# Altium schematic sheet [6]-CHARGER.SchDoc
size A4
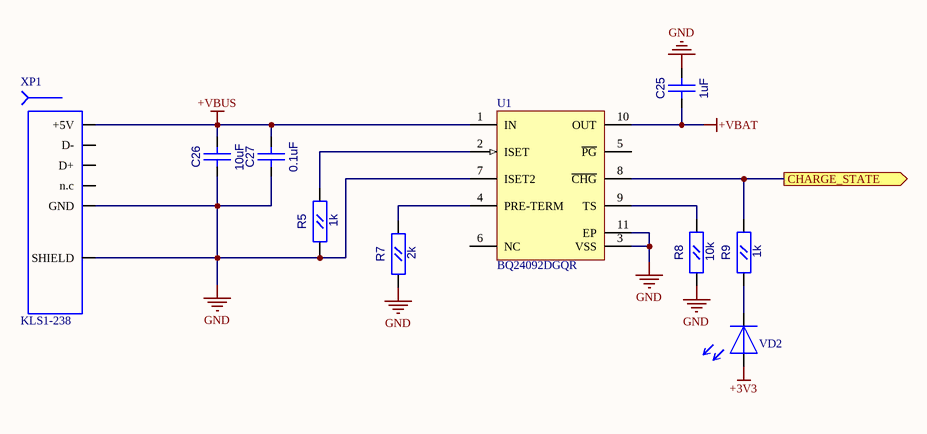
[diagram p0: [6]-CHARGER.SchDoc]

## Parts
C25  1uF  [CC0603]
C26  10uF  [CC0805]
C27  0.1uF  [CC0603]
R5  1k  [RC0603]
R7  2k  [RC0603]
R8  10k  [RC0603]
R9  1k  [RC0603]
U1  BQ24092DGQR  [DGQ10-1675X1445TP_N]
VD2  LED_0805  [LED0805]  (value not drawn)
XP1  KLS1-238  [KLS1-238]

## Ports
CHARGE_STATE (out)

## Nets
+3V3: VD2.1
+VBAT: C25.1(A) U1.10(OUT)
+VBUS: C26.2(B) C27.2(B) U1.1(IN) XP1.1(+5V)
GND: C25.2(B) C26.1(A) C27.1(A) R5.1(A) R7.1(A) R8.1(A) U1.3(VSS) U1.7(ISET2) U1.11(EP) XP1.5(GND) XP1.6(SHIELD)
CHARGE_STATE: R9.2(B) U1.8(~{CHG}) ; port CHARGE_STATE
NetR5_2: R5.2(B) U1.2(ISET)
NetR7_2: R7.2(B) U1.4(PRE-TERM)
NetR8_2: R8.2(B) U1.9(TS)
NetR9_1: R9.1(A) VD2.2

Not connected (* = marked no-connect by the designer): U1 5(~{PG}) 6(NC); XP1 2(D-) 3(D+) 4(n.c)

## Library data of the parts
C25 C27 = CC0603
  C25: Value: 1uF
  C27: Value: 0.1uF
C26 = CC0805: Value: 10uF
R5 R7-R9 = RC0603
  R5 R9: Value: 1k
  R7: Value: 2k
  R8: Value: 10k
U1 = BQ24092DGQR: 1 A, Single-Input, Single-Cell Li-Ion Battery Charger with Operation Over JEITA and 10 k ohm NTC, 4.5 V, -40 to 150 degC, 10-pin MSOP-PowerPAD (DGQ), Green (RoHS & no Sb/Br); Manufacturer: Texas Instruments; Lead Acid: N; SubFamily: Battery Charge Management; Vin(Min)(V): 4.5; DatasheetVersion: SLUS968C; PackageVersion: revF, Nov-2011; PackageReference: DGQ10-1675X1445TP; PackageDescription: 10-Pin PowerPAD Plastic Small Outline 0.5 mm Pitch, Exposed Pad; Supplier 1: Digi-Key; Supplier Part Number 1: BQ24092DGQR-ND; Supplier 2: Newark; Supplier Part Number 2: 79R7874; Supplier 3: Mouser; Supplier Part Number 3: 595-BQ24092DGQR; Eco-Plan: Green (RoHS & no Sb/Br); Li-Ion: N; Li-Polymer: N; NiCd: N; NiMH: N; Over Voltage Protection: N; Mounting Technology: Surface Mount; PartNumber: BQ24092DGQR; Code_JEDEC: MO-187-BA-T; ComponentLink1Description: Datasheet; ComponentLink1URL: http://www.ti.com/general/docs/lit/getliterature.tsp?genericPartNumber=BQ24092&fileType=pdf
XP1 = MicroUSB KLS1-238: Value: KLS1-238
VD2 = LED_0805: Value: LED_0805